# Altium schematic sheet ESP32-C6-CALCULATOR SCHEMATIC.SchDoc
size 381 x 241 mm; SheetNumber: 1; SheetTotal: 1
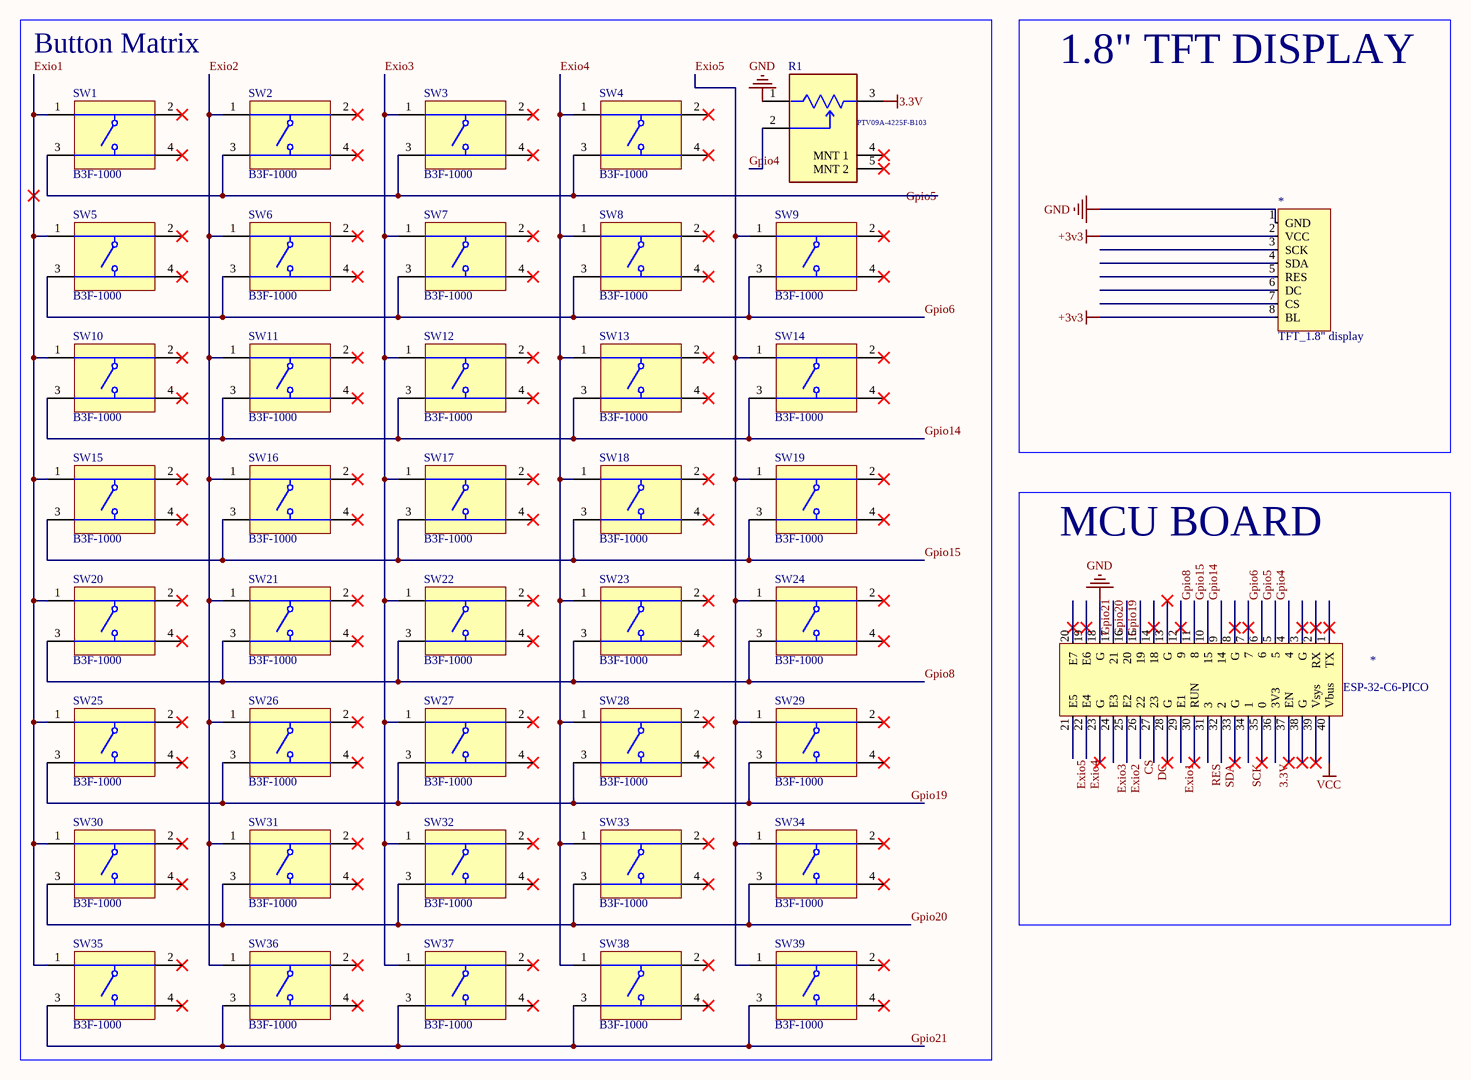
[diagram p0: ESP32-C6-CALCULATOR SCHEMATIC.SchDoc]

## Parts
(Parts that share a designator on the sheet are numbered #1, #2 ... from top to bottom, then left to right.)
*#1  TFT_1.8" display  [DIP16]
*#2  ESP-32-C6-PICO  [ESP32-C6-Pico]
R1  PTV09A-4225F-B103  [FP-PTV09A-4-MFG]
SW1  B3F-1000  [OMRON-B3F-1000-4_V]
SW2  B3F-1000  [OMRON-B3F-1000-4_V]
SW3  B3F-1000  [OMRON-B3F-1000-4_V]
SW4  B3F-1000  [OMRON-B3F-1000-4_V]
SW5  B3F-1000  [OMRON-B3F-1000-4_V]
SW6  B3F-1000  [OMRON-B3F-1000-4_V]
SW7  B3F-1000  [OMRON-B3F-1000-4_V]
SW8  B3F-1000  [OMRON-B3F-1000-4_V]
SW9  B3F-1000  [OMRON-B3F-1000-4_V]
SW10  B3F-1000  [OMRON-B3F-1000-4_V]
SW11  B3F-1000  [OMRON-B3F-1000-4_V]
SW12  B3F-1000  [OMRON-B3F-1000-4_V]
SW13  B3F-1000  [OMRON-B3F-1000-4_V]
SW14  B3F-1000  [OMRON-B3F-1000-4_V]
SW15  B3F-1000  [OMRON-B3F-1000-4_V]
SW16  B3F-1000  [OMRON-B3F-1000-4_V]
SW17  B3F-1000  [OMRON-B3F-1000-4_V]
SW18  B3F-1000  [OMRON-B3F-1000-4_V]
SW19  B3F-1000  [OMRON-B3F-1000-4_V]
SW20  B3F-1000  [OMRON-B3F-1000-4_V]
SW21  B3F-1000  [OMRON-B3F-1000-4_V]
SW22  B3F-1000  [OMRON-B3F-1000-4_V]
SW23  B3F-1000  [OMRON-B3F-1000-4_V]
SW24  B3F-1000  [OMRON-B3F-1000-4_V]
SW25  B3F-1000  [OMRON-B3F-1000-4_V]
SW26  B3F-1000  [OMRON-B3F-1000-4_V]
SW27  B3F-1000  [OMRON-B3F-1000-4_V]
SW28  B3F-1000  [OMRON-B3F-1000-4_V]
SW29  B3F-1000  [OMRON-B3F-1000-4_V]
SW30  B3F-1000  [OMRON-B3F-1000-4_V]
SW31  B3F-1000  [OMRON-B3F-1000-4_V]
SW32  B3F-1000  [OMRON-B3F-1000-4_V]
SW33  B3F-1000  [OMRON-B3F-1000-4_V]
SW34  B3F-1000  [OMRON-B3F-1000-4_V]
SW35  B3F-1000  [OMRON-B3F-1000-4_V]
SW36  B3F-1000  [OMRON-B3F-1000-4_V]
SW37  B3F-1000  [OMRON-B3F-1000-4_V]
SW38  B3F-1000  [OMRON-B3F-1000-4_V]
SW39  B3F-1000  [OMRON-B3F-1000-4_V]

## Blocks framed on the sheet
Button Matrix: R1 SW1-SW39
1.8" TFT DISPLAY: *#1
MCU BOARD: *#2

## Nets
3.3V: *#2.36(3V3) R1.3
+3v3: *#1.2(VCC) *#1.8(BL)
GND: *#1.1(GND) *#2.18(G) R1.1
VCC: *#2.40(Vbus)
CS: *#2.26(22)
DC: *#2.27(23)
Exio1: *#2.29(E1) SW1.1 SW5.1 SW10.1 SW15.1 SW20.1 SW25.1 SW30.1 SW35.1
Exio2: *#2.25(E2) SW2.1 SW6.1 SW11.1 SW16.1 SW21.1 SW26.1 SW31.1 SW36.1
Exio3: *#2.24(E3) SW3.1 SW7.1 SW12.1 SW17.1 SW22.1 SW27.1 SW32.1 SW37.1
Exio4: *#2.22(E4) SW4.1 SW8.1 SW13.1 SW18.1 SW23.1 SW28.1 SW33.1 SW38.1
Exio5: *#2.21(E5) SW9.1 SW14.1 SW19.1 SW24.1 SW29.1 SW34.1 SW39.1
Gpio4: *#2.4 R1.2
Gpio5: *#2.5 SW1.3 SW2.3 SW3.3 SW4.3
Gpio6: *#2.6 SW5.3 SW6.3 SW7.3 SW8.3 SW9.3
Gpio8: *#2.11(8) SW20.3 SW21.3 SW22.3 SW23.3 SW24.3
Gpio14: *#2.9(14) SW10.3 SW11.3 SW12.3 SW13.3 SW14.3
Gpio15: *#2.10(15) SW15.3 SW16.3 SW17.3 SW18.3 SW19.3
Gpio19: *#2.15(19) SW25.3 SW26.3 SW27.3 SW28.3 SW29.3
Gpio20: *#2.16(20) SW30.3 SW31.3 SW32.3 SW33.3 SW34.3
Gpio21: *#2.17(21) SW35.3 SW36.3 SW37.3 SW38.3 SW39.3
RES: *#2.31(3)
SCK: *#2.34(1)
SDA: *#2.32(2)

Not connected (* = marked no-connect by the designer): *#1 3(SCK) 4(SDA) 5(RES) 6(DC) 7(CS); *#2 1(TX)* 2(RX)* 3(G)* 7* 8(G)* 12(9)* 13(G)* 14(18)* 19(E6)* 20(E7)* 23(G)* 28(G)* 30(RUN)* 33(G)* 35(0)* 37(EN)* 38(G)* 39(Vsys)*; R1 4(MNT_1)* 5(MNT_2)*; SW1 2* 4*; SW2 2* 4*; SW3 2* 4*; SW4 2* 4*; SW5 2* 4*; SW6 2* 4*; SW7 2* 4*; SW8 2* 4*; SW9 2* 4*; SW10 2* 4*; SW11 2* 4*; SW12 2* 4*; SW13 2* 4*; SW14 2* 4*; SW15 2* 4*; SW16 2* 4*; SW17 2* 4*; SW18 2* 4*; SW19 2* 4*; SW20 2* 4*; SW21 2* 4*; SW22 2* 4*; SW23 2* 4*; SW24 2* 4*; SW25 2* 4*; SW26 2* 4*; SW27 2* 4*; SW28 2* 4*; SW29 2* 4*; SW30 2* 4*; SW31 2* 4*; SW32 2* 4*; SW33 2* 4*; SW34 2* 4*; SW35 2* 4*; SW36 2* 4*; SW37 2* 4*; SW38 2* 4*; SW39 2* 4*

## Library data of the parts
R1 = CMP-07234-000052-1: POT 10K OHM 1/20W CARBON LINEAR; Power Rating: 50mW; Number of Gangs: 1; Hole Diameter: 9.1mm; Actuator Diameter: 0.236inch; Resistance Tolerance: 20%; Resistance: 10kR; Actuator Length: 0.984inch; Min Operating Temperature: -10°C; RoHS Compliant: Yes; Technology: CARBON FILM; Radiation Hardening: No; Taper: Linear; Military Standard: Not; Type: Potentiometer; Mount: Through Hole; Length: 11.4mm; Tolerance: 20%; Max Power Dissipation: 50mW; Max Operating Temperature: 50°C; Package Quantity: 100; Termination: PCB; Packaging: Bulk; Depth: 12.5mm; Resistor Type: Carbon; Number of Turns: 1; Series: Pro Audio PTV09; Height: 12.5mm; REACH SVHC: No SVHC
SW1-SW39 = CMP-1677-00002-1: Tactile Switch, SPST-NO, 0.05 A, 5 to 24 V, -25 to 70 degC, 4-Pin THD, RoHS, Bulk; Shielding: Shielded; Gender: Female; Capacitance: -45 f; Voltage Rating: 150 V; Current Rating: 1.5 A; Radiation Hardening: No; Contact Plating: Gold; Height: 14.99 mm; Min Operating Temperature: -40 degC; Packaging: Tray; ComponentLink2Description: Datasheet; ComponentLink1URL: http://www.omron.com/; Lead Pitch: 1.27 mm; RoHSCompliant: true; Pins: 8; PackageReference: B3F-1000; Width: 25.4 mm; Contact Material: Brass; ComponentLink2URL: http://www.omron.com/ecb/products/pdf/en-b3f.pdf; PackageDescription: 4-Pin Through Hole Device, Body 6 x 6 mm; DatasheetVersion: Jan-15; ComponentLink1Description: Manufacturer URL; Package Quantity: 1080; Mount: Through Hole; Length: 18.34 mm; Max Operating Temperature: 70 degC